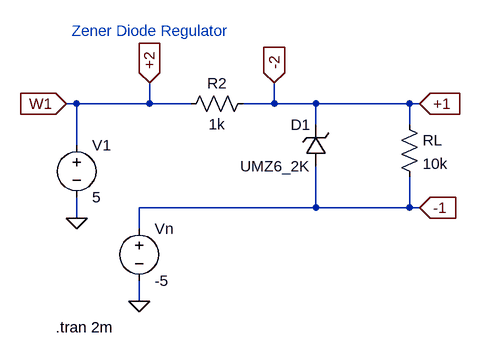
[diagram p0: schematic zener_reg_ltspice.asc]
zener_reg_ltspice.asc, the LTspice schematic file:
Version 4
SHEET 1 880 680
WIRE -240 96 -256 96
WIRE -128 96 -128 64
WIRE -128 96 -240 96
WIRE -64 96 -128 96
WIRE 64 96 64 64
WIRE 64 96 16 96
WIRE 128 96 64 96
WIRE 272 96 128 96
WIRE 288 96 272 96
WIRE 128 128 128 96
WIRE 272 128 272 96
WIRE -240 160 -240 96
WIRE 128 256 128 192
WIRE 128 256 -144 256
WIRE 272 256 272 208
WIRE 272 256 128 256
WIRE 288 256 272 256
WIRE -240 272 -240 240
WIRE -144 288 -144 256
WIRE -144 400 -144 368
FLAG -144 400 0
FLAG -240 272 0
FLAG -256 96 W1
IOPIN -256 96 In
FLAG 288 96 +1
IOPIN 288 96 In
FLAG -128 64 +2
IOPIN -128 64 In
FLAG 64 64 -2
IOPIN 64 64 In
FLAG 288 256 -1
IOPIN 288 256 In
SYMBOL zener 144 192 R180
WINDOW 0 24 64 Left 2
WINDOW 3 24 0 Left 2
SYMATTR InstName D1
SYMATTR Value UMZ6_2K
SYMATTR Description Diode
SYMATTR Type diode
SYMBOL res 32 80 R90
WINDOW 0 0 56 VBottom 2
WINDOW 3 32 56 VTop 2
SYMATTR InstName R2
SYMATTR Value 1k
SYMBOL voltage -144 272 R0
WINDOW 123 0 0 Left 0
WINDOW 39 0 0 Left 0
SYMATTR InstName Vn
SYMATTR Value -5
SYMBOL voltage -240 144 R0
WINDOW 123 0 0 Left 0
WINDOW 39 0 0 Left 0
SYMATTR InstName V1
SYMATTR Value 5
SYMBOL res 256 112 R0
SYMATTR InstName RL
SYMATTR Value 10k
TEXT -272 440 Left 2 !.tran 2m
TEXT -248 -16 Left 2 ;Zener Diode Regulator

The netlist it stands for:
* zener_reg_ltspice.asc
D1 -1 -2 UMZ6_2K
R2 -2 +2 1k
Vn -1 0 -5
V1 +2 0 5
RL -2 -1 10k
.model D D
.lib standard.dio
.tran 2m
* Zener Diode Regulator
.backanno
.end